# Altium schematic sheet VibrationMotor.SchDoc
size A4; SheetNumber: 6; SheetTotal: 6
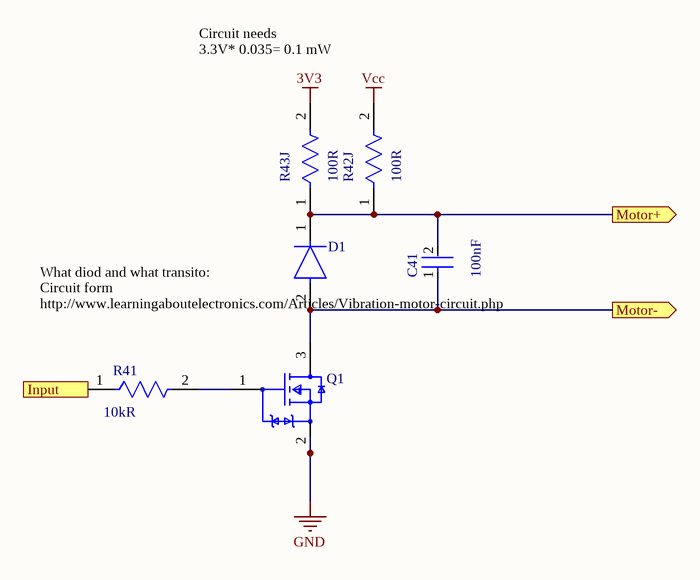
[diagram p0: VibrationMotor.SchDoc]

## Parts
C41  Capacitance: 100nF  [FP-0603-L_1_6_0_1-W_0_8_0-IPC_B]  (hidden comment: EMK107B7104KAHT)
D1  LS4448GS08  [FP-6_560-5006_01-4-MFG]  (value not drawn)
Q1  DMG2302UK-7  [FP-SOT23-MFG]  (value not drawn)
R41  Resistance: 10kR  [FP-RNCP0603-IPC_A]  (hidden comment: RNCP0603FTD10K0)
R42J  Resistance: 100R  [FP-ESR03-MFG]  (hidden comment: ESR03EZPJ101)
R43J  Resistance: 100R  [FP-ESR03-MFG]  (hidden comment: ESR03EZPJ101)

## Ports
Input (in), Motor+ (out), Motor- (out)

## Nets
3V3: R43J.2
GND: Q1.2(S)
Vcc: R42J.2
Input: R41.1 ; port Input
Motor+: C41.2 D1.1(C) R42J.1 R43J.1 ; port Motor+
Motor-: C41.1 D1.2(A) Q1.3(D) ; port Motor-
NetQ1_1: Q1.1(G) R41.2

## Notes on the sheet
- Circuit needs
  3.3V* 0.035= 0.1 mW
  With Vibro Motor
  https://www.distrelec.ch/de/vibrationsmotor-seeed-studio-316040004/p/30214484
- What diod and what transito:
  Circuit form http://www.learningaboutelectronics.com/Articles/Vibration-motor-circuit.php

## Library data of the parts
C41 = CMP-14477-003798-2: None; Voltage Rating (DC): 16V; Tolerance: 10%; Package Quantity: 4000; Packaging: Tape and Reel; Lead Free: Lead Free; Voltage Rating: 16V; Halogen Free: Halogen Free; Case/Package: 0603
D1 = CMP-02540-000047-1: DIODE GEN PURP 100V 300MA SOD80; Manufacturer: Vishay; Max Junction Temp: +175°C; Reverse Voltage: 75V; Peak Reverse Current: 5uA; Automotive Grade: Grade 0; Value: 4pF; Max Surge Forward Current: 2A; Category: Diode; Forward Current: 300mA; ComponentLink2Description: Datasheet; Lead Free: Yes; Automotive: Yes; Device Class L1: Discrete Semiconductors; Temperature: to +175°C; Package: 6.560-5006.01-4; Max Repetitive Reverse Voltage: 100V; RoHS: TRUE; Manufacturer Part Number: LS4448GS08; ComponentLink2URL: http://www.vishay.com/docs/85561/ls4148.pdf; Device Class L3: Rectifier Diodes; Capacitance: 4pF; Octopart: https://octopart.com/ls4448gs08-vishay-55433966; Digikey Description: DIODE GEN PURP 100V 300MA SOD80; Device Class L2: Diodes; Height: 1.6mm; Mouser Description: Diodes - General Purpose, Power, Switching 100V Io/150mA 2.0 Amp IFSM; Temperature Range High: +175°C
Q1 = CMP-12801-000001-1: MOSFET N-CH 20V 2.8A SOT23; Manufacturer: Diodes Inc.; Reverse Recovery Time: 5.3ns; Gate Charge At Vgs: 2.8nC @ 10V; Turn On Delay Time: 0.6ns; Pulse Drain Current: 12A; Max Forward Diode Voltage: 1.2V; Reverse Recovery Charge: 0.5nC; Automotive Grade: Grade 0; Threshold Vgs Min: 0.3V; Number Of N Channels: 1; Standoff Height: 0.013mm; Typ Forward Diode Voltage: 0.7V; Drain To Source Resistance: 61mΩ; Rthja Max: 192°C/W; Max Junction Temp: +150°C; Input Capacitace At Vds: 130pF @ 10V; Threshold Vgs Max: 1V; Turn Off Delay Time: 4.2ns; Depletion Mode: False; Gate To Source Voltage: 12V; Power Dissipation: 0.66W; Device Class L1: Discrete Semiconductors; Footprint Url: https://www.diodes.com/assets/Package-Files/SOT23.pdf; Lead Free: Yes; Manufacturer Part Number: DMG2302UK-7; Temperature Range High: +150°C; Drain To Source Voltage: 20V; Category: Trans; Digikey Description: MOSFET N-CH 20V 2.8A SOT23; RoHS: TRUE; Device Class L2: Transistors; Height: 1.1mm; Automotive: Yes; Package: SOT23; Drain To Source Breakdown Voltage: 20V; Continuous Drain Current: 2.8A; ComponentLink2Description: Datasheet; Device Class L3: MOSFETs; Octopart: https://octopart.com/dmg2302uk-7-diodes+inc.-73850182; Temperature Range Low: -55°C; Temperature: -55°C to +150°C; Number Of Channels: 1; ComponentLink2URL: https://www.diodes.com/assets/Datasheets/DMG2302UK.pdf
R41 = CMP-26527-000099-1: 10kΩ ±1% 0.125W 0603 High Power Anti-Sulfur Thin Film Chip Resistor; Max Power Dissipation: 125mW; Temperature Coefficient: 100ppm/°C; Max Operating Temperature: 155°C; Width: 0.031inch; Height: 0.02inch; Lead Free: Lead Free; Contact Plating: Tin; Tolerance: 1%; Resistor Type: Thin Film; Series: RNCP; RoHS Compliant: Yes; Features: Moisture Resistant; Min Operating Temperature: -55°C; Case Code (Metric): 1608; Case/Package: 0603; Mount: Surface Mount; Packaging: Tape and Reel; Radiation Hardening: No; Length: 0.059inch; Number of Terminations: 2; Case Code (Imperial): 0603
R42J R43J = CMP-08839-000028-1: 100Ω ±5% 0.25W 0603 Anti-Surge Chip Resistor AEC-Q200; Power Rating: 200mW; Temperature Coefficient: 200ppm/°C; Max Power Dissipation: 250mW; Case Code (Imperial): 0603; Number of Terminations: 2; RoHS Compliant: Yes; Series: ESR; Lead Free: Lead Free; Features: Automotive AEC-Q200; Case/Package: 0603; Tolerance: 5%; Min Operating Temperature: -55°C; Size Code: 0603; Case Code (Metric): 1608; Max Operating Temperature: 155°C; Packaging: Tape and Reel